# Altium schematic sheet SAMV71_Xplained_Ultra_Memory.SchDoc: Memory
size A3; Organization: ATMEL Norway; Address1: Vestre Rosten 79; Address2: N-7075 TILLER; Address3: NORWAY; DocumentNumber: A09-2407; Revision: 11; SheetNumber: 9; SheetTotal: 13; DrawnBy: Microchip Norway; Engineer: AH; PageSetup: Record=PageOptions|CenterHorizontal=True|CenterVertical=True|PrintScale=1.01|XCorrection=1.00|YCorrection=1.00|PrintKind=1|BorderSize=5000000|LeftOffset=0|BottomOffset=0|Orientation=2|PaperLength=1000|PaperWidth=1000|Scale=100|PaperSource=7|PrintQuality=-4|MediaType=1|DitherType=10|PaperKind=A3 (297 x 420 mm)|PrintScaleMode=1; ProjectTitle: SAM V71 Xplained Ultra; PCBNumber: A08-2216; PCBRevision: 4
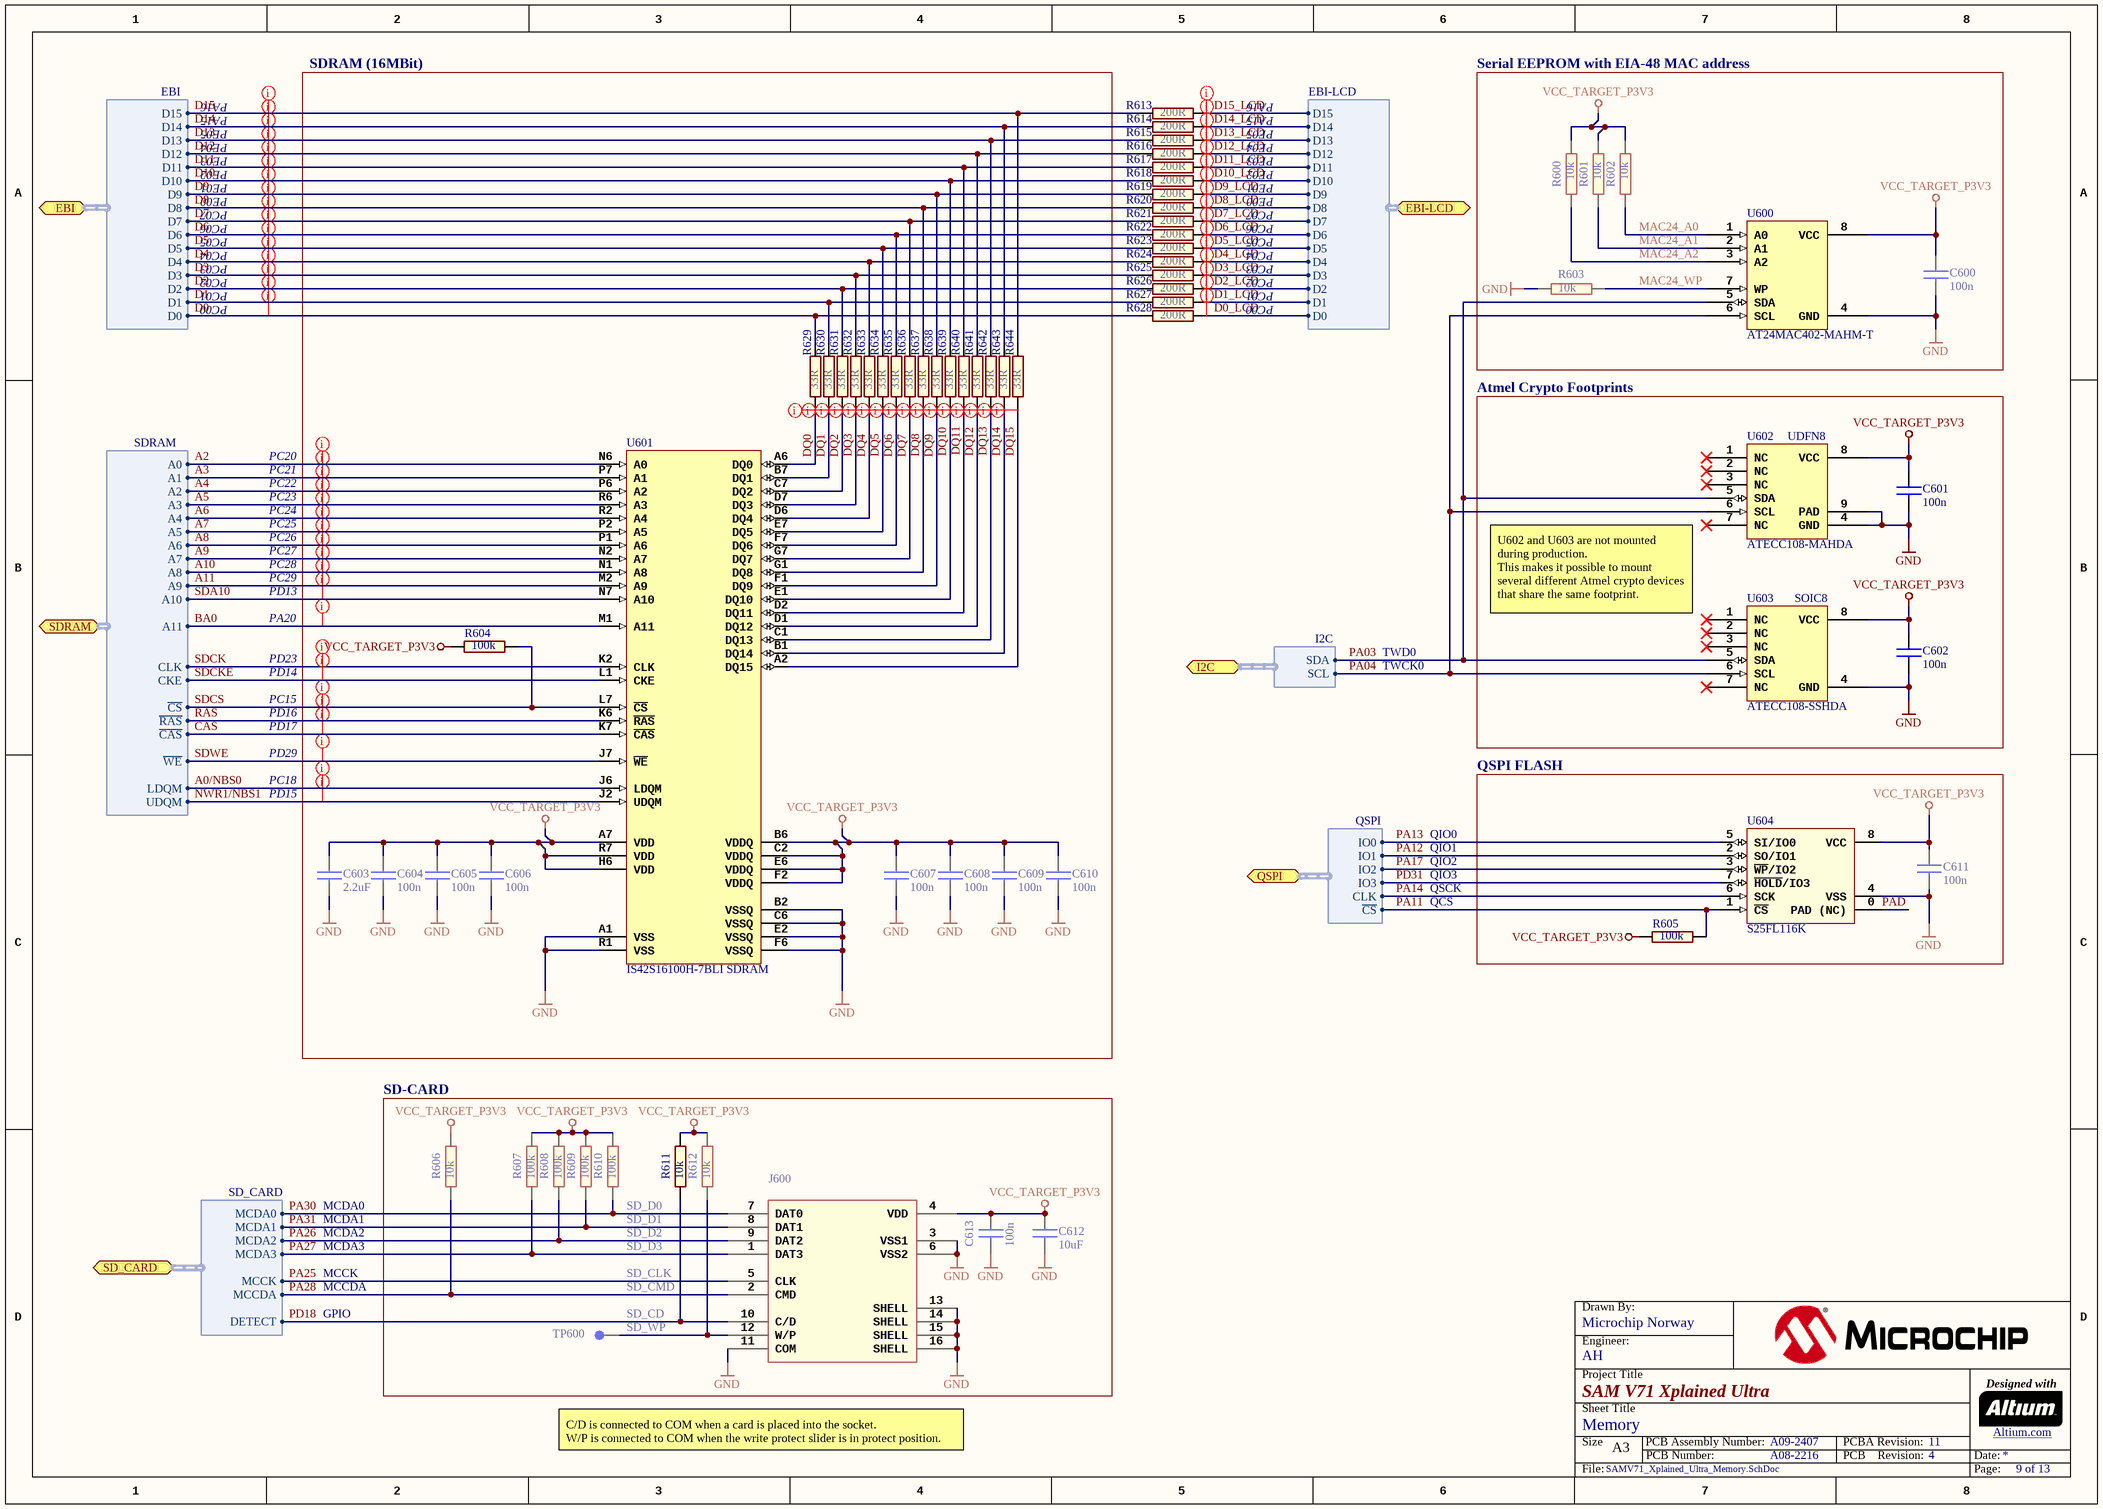
[diagram p0: SAMV71_Xplained_Ultra_Memory.SchDoc]

## Parts
C600  value 100n  [AP1-00001]
C601  value 100n  [AP1-00001]
C602  value 100n  [AP1-00001]
C603  value 2.2uF  [AP1-00053]  (hidden comment: Farnell no: 1288200)
C604  value 100n  [AP1-00053]
C605  value 100n  [AP1-00053]
C606  value 100n  [AP1-00053]
C607  value 100n  [AP1-00053]
C608  value 100n  [AP1-00053]
C609  value 100n  [AP1-00053]
C610  value 100n  [AP1-00053]
C611  value 100n  [AP1-00001]
C612  value 10uF  [AP1-00041]
C613  value 100n  [AP1-00001]
J600  (no value)  [AP8-00377]
R600  value 10k  [AP2-00000]
R601  value 10k  [AP2-00000]
R602  value 10k  [AP2-00000]
R603  value 10k  [AP2-00000]
R604  value 100k  [AP2-00000]
R605  value 100k  [AP2-00000]
R606  value 10k  [AP2-00000]
R607  value 100k  [AP2-00000]
R608  value 100k  [AP2-00000]
R609  value 100k  [AP2-00000]
R610  value 100k  [AP2-00000]
R611  value 10k  [AP2-00000]
R612  value 10k  [AP2-00000]
R613  value 200R  [AP2-00011]
R614  value 200R  [AP2-00011]
R615  value 200R  [AP2-00011]
R616  value 200R  [AP2-00011]
R617  value 200R  [AP2-00011]
R618  value 200R  [AP2-00011]
R619  value 200R  [AP2-00011]
R620  value 200R  [AP2-00011]
R621  value 200R  [AP2-00011]
R622  value 200R  [AP2-00011]
R623  value 200R  [AP2-00011]
R624  value 200R  [AP2-00011]
R625  value 200R  [AP2-00011]
R626  value 200R  [AP2-00011]
R627  value 200R  [AP2-00011]
R628  value 200R  [AP2-00011]
R629  value 33R  [AP2-00011]
R630  value 33R  [AP2-00011]
R631  value 33R  [AP2-00011]
R632  value 33R  [AP2-00011]
R633  value 33R  [AP2-00011]
R634  value 33R  [AP2-00011]
R635  value 33R  [AP2-00011]
R636  value 33R  [AP2-00011]
R637  value 33R  [AP2-00011]
R638  value 33R  [AP2-00011]
R639  value 33R  [AP2-00011]
R640  value 33R  [AP2-00011]
R641  value 33R  [AP2-00011]
R642  value 33R  [AP2-00011]
R643  value 33R  [AP2-00011]
R644  value 33R  [AP2-00011]
TP600  (no value)  [AP8-00010]  (no BOM)
U600  value AT24MAC402-MAHM-T  [AP6-00186]
U601  value IS42S16100H-7BLI SDRAM  [AP6-00400]
U602  value ATECC108-MAHDA  [AP6-00409]
U603  value ATECC108-SSHDA  [AP6-00071]
U604  value S25FL116K  [AP6-00402]  (hidden comment: Also available as 32- and 64-Mbit.)

## Blocks framed on the sheet
SDRAM (16MBit): C603-C610 R604 R629-R644 U601
Serial EEPROM with EIA-48 MAC address: C600 R600-R603 U600
Atmel Crypto Footprints: C601 C602 U602 U603
QSPI FLASH: C611 R605 U604
SD-CARD: C612 C613 J600 R606-R612 TP600

## Ports
EBI (harness EBI), EBI-LCD (harness EBI-LCD), I2C (harness I2C), QSPI (harness QSPI), SD_CARD (harness SD_CARD), SDRAM (harness SDRAM)

## Harnesses
SD_CARD: MCCDA, MCCK, MCDA3, MCDA2, MCDA1, MCDA0, DETECT
EBI: D0, D1, D2, D3, D4, D5, D6, D7, D8, D9, D10, D11, D12, D13, D14, D15
QSPI: CLK, IO3, IO2, IO0, IO1, ~{CS}
SDRAM: ~{CAS}, ~{RAS}, ~{CS}, CLK, CKE, ~{WE}, LDQM, UDQM, A0, A1, A2, A3, A4, A5, A6, A7, A8, A9, A10, A11
I2C: SDA, SCL
EBI-LCD: D0, D1, D2, D3, D4, D5, D6, D7, D8, D9, D10, D11, D12, D13, D14, D15

## Nets
GND: C600.2 C601.2 C602.2 C603.2 C604.2 C605.2 C606.2 C607.2 C608.2 C609.2 C610.2 C611.2 C612.2 C613.2 J600.3(VSS1) J600.6(VSS2) J600.11(COM) J600.13(SHELL) J600.14(SHELL) J600.15(SHELL) J600.16(SHELL) R603.1 U600.4(GND) U601.A1(VSS) U601.B2(VSSQ) U601.C6(VSSQ) U601.E2(VSSQ) U601.F6(VSSQ) U601.R1(VSS) U602.4(GND) U602.9(PAD) U603.4(GND) U604.4(VSS)
VCC_TARGET_P3V3: C600.1 C601.1 C602.1 C603.1 C604.1 C605.1 C606.1 C607.1 C608.1 C609.1 C610.1 C611.1 C612.1 C613.1 J600.4(VDD) R600.2 R601.2 R602.2 R604.1 R605.1 R606.2 R607.2 R608.2 R609.2 R610.2 R611.2 R612.2 U600.8(VCC) U601.A7(VDD) U601.B6(VDDQ) U601.C2(VDDQ) U601.E6(VDDQ) U601.F2(VDDQ) U601.H6(VDD) U601.R7(VDD) U602.8(VCC) U603.8(VCC) U604.8(VCC)
A0/NBS0: U601.J6(LDQM) ; port SDRAM.LDQM
A2: U601.N6(A0) ; port SDRAM.A0
A3: U601.P7(A1) ; port SDRAM.A1
A4: U601.P6(A2) ; port SDRAM.A2
A5: U601.R6(A3) ; port SDRAM.A3
A6: U601.R2(A4) ; port SDRAM.A4
A7: U601.P2(A5) ; port SDRAM.A5
A8: U601.P1(A6) ; port SDRAM.A6
A9: U601.N2(A7) ; port SDRAM.A7
A10: U601.N1(A8) ; port SDRAM.A8
A11: U601.M2(A9) ; port SDRAM.A9
BA0: U601.M1(A11) ; port SDRAM.A11
CAS: U601.K7(~{CAS}) ; port SDRAM.~{CAS}
D0: R628.2 R629.1 ; port EBI.D0
D0_LCD: R628.1 ; port EBI-LCD.D0
D1: R627.2 R630.1 ; port EBI.D1
D1_LCD: R627.1 ; port EBI-LCD.D1
D2: R626.2 R631.1 ; port EBI.D2
D2_LCD: R626.1 ; port EBI-LCD.D2
D3: R625.2 R632.1 ; port EBI.D3
D3_LCD: R625.1 ; port EBI-LCD.D3
D4: R624.2 R633.1 ; port EBI.D4
D4_LCD: R624.1 ; port EBI-LCD.D4
D5: R623.2 R634.1 ; port EBI.D5
D5_LCD: R623.1 ; port EBI-LCD.D5
D6: R622.2 R635.1 ; port EBI.D6
D6_LCD: R622.1 ; port EBI-LCD.D6
D7: R621.2 R636.1 ; port EBI.D7
D7_LCD: R621.1 ; port EBI-LCD.D7
D8: R620.2 R637.1 ; port EBI.D8
D8_LCD: R620.1 ; port EBI-LCD.D8
D9: R619.2 R638.1 ; port EBI.D9
D9_LCD: R619.1 ; port EBI-LCD.D9
D10: R618.2 R639.1 ; port EBI.D10
D10_LCD: R618.1 ; port EBI-LCD.D10
D11: R617.2 R640.1 ; port EBI.D11
D11_LCD: R617.1 ; port EBI-LCD.D11
D12: R616.2 R641.1 ; port EBI.D12
D12_LCD: R616.1 ; port EBI-LCD.D12
D13: R615.2 R642.1 ; port EBI.D13
D13_LCD: R615.1 ; port EBI-LCD.D13
D14: R614.2 R643.1 ; port EBI.D14
D14_LCD: R614.1 ; port EBI-LCD.D14
D15: R613.2 R644.1 ; port EBI.D15
D15_LCD: R613.1 ; port EBI-LCD.D15
DQ0: R629.2 U601.A6(DQ0)
DQ1: R630.2 U601.B7(DQ1)
DQ2: R631.2 U601.C7(DQ2)
DQ3: R632.2 U601.D7(DQ3)
DQ4: R633.2 U601.D6(DQ4)
DQ5: R634.2 U601.E7(DQ5)
DQ6: R635.2 U601.F7(DQ6)
DQ7: R636.2 U601.G7(DQ7)
DQ8: R637.2 U601.G1(DQ8)
DQ9: R638.2 U601.F1(DQ9)
DQ10: R639.2 U601.E1(DQ10)
DQ11: R640.2 U601.D2(DQ11)
DQ12: R641.2 U601.D1(DQ12)
DQ13: R642.2 U601.C1(DQ13)
DQ14: R643.2 U601.B1(DQ14)
DQ15: R644.2 U601.A2(DQ15)
MAC24_A0: R602.1 U600.1(A0)
MAC24_A1: R601.1 U600.2(A1)
MAC24_A2: R600.1 U600.3(A2)
MAC24_WP: R603.2 U600.7(WP)
NWR1/NBS1: U601.J2(UDQM) ; port SDRAM.UDQM
PA03: U600.5(SDA) U602.5(SDA) U603.5(SDA) ; port I2C.SDA
PA04: U600.6(SCL) U602.6(SCL) U603.6(SCL) ; port I2C.SCL
PA11: R605.2 U604.1(~{CS}) ; port QSPI.~{CS}
PA12: U604.2(SO/IO1) ; port QSPI.IO1
PA13: U604.5(SI/IO0) ; port QSPI.IO0
PA14: U604.6(SCK) ; port QSPI.CLK
PA17: U604.3(~{WP}/IO2) ; port QSPI.IO2
PA25: J600.5(CLK) ; port SD_CARD.MCCK
PA26: J600.9(DAT2) R608.1 ; port SD_CARD.MCDA2
PA27: J600.1(DAT3) R607.1 ; port SD_CARD.MCDA3
PA28: J600.2(CMD) R606.1 ; port SD_CARD.MCCDA
PA30: J600.7(DAT0) R610.1 ; port SD_CARD.MCDA0
PA31: J600.8(DAT1) R609.1 ; port SD_CARD.MCDA1
PAD: U604.0(PAD_(NC))
PD18: J600.10(C/D) R611.1 ; port SD_CARD.DETECT
PD31: U604.7(~{HOLD}/IO3) ; port QSPI.IO3
RAS: U601.K6(~{RAS}) ; port SDRAM.~{RAS}
SDA10: U601.N7(A10) ; port SDRAM.A10
SDCK: U601.K2(CLK) ; port SDRAM.CLK
SDCKE: U601.L1(CKE) ; port SDRAM.CKE
SDCS: R604.2 U601.L7(~{CS}) ; port SDRAM.~{CS}
SDWE: U601.J7(~{WE}) ; port SDRAM.~{WE}
NetJ600_12: J600.12(W/P) R612.1 TP600.1

Not connected (* = marked no-connect by the designer): U602 1(NC)* 2(NC)* 3(NC)* 7(NC)*; U603 1(NC)* 2(NC)* 3(NC)* 7(NC)*

## Layout directives
net class ADDRESS_BUS: A0/NBS0, A2, A3, A4, A5, A6, A7, A8, A9, A10, A11, BA0, CAS, NWR1/NBS1, RAS, SDA10, SDCK, SDCS, SDWE
net class DATA_BUS: D0, D4, D5, D7, D8, D9, D10, D11, D12, D13, D14
net class DATA_BUS; rule Fabrication Testpoint Usage [Testpoint - Allowed    Multiple - Not Allowed]; rule Assembly Testpoint Usage [Testpoint - Allowed    Multiple - Not Allowed]: D0_LCD, D1, D1_LCD, D2, D2_LCD, D3, D3_LCD, D4_LCD, D5_LCD, D6, D6_LCD, D7_LCD, D8_LCD, D9_LCD, D10_LCD, D11_LCD, D12_LCD, D13_LCD, D14_LCD, D15, D15_LCD, DQ0, DQ1, DQ2, DQ3, DQ4, DQ5, DQ6, DQ7, DQ8, DQ9, DQ10, DQ11, DQ12, DQ13, DQ14, DQ15
net class ADDRESS_BUS; rule Fabrication Testpoint Usage [Testpoint - Allowed    Multiple - Not Allowed]; rule Assembly Testpoint Usage [Testpoint - Allowed    Multiple - Not Allowed]: SDCKE

## Notes on the sheet
- PA15
- PA16
- PE01
- PE02
- PE03
- PE04
- PE05
- PC04
- PC05
- PC06
- PC07
- PE00
- PC00
- PC01
- PC02
- PC03
- (near U602) UDFN8
- PC20
- PC21
- PC22
- PC23
- PC24
- PC25
- PC26
- PC27
- PC28
- PC29
- PD13
- PA20
- U602 and U603 are not mounted during production.
  This makes it possible to mount several different Atmel crypto devices that share the same footprint.
- (near U603) SOIC8
- PD14
- PD23
- PC15
- PD16
- TWCK0
- TWD0
- PD17
- PC18
- PD29
- PD15
- QIO0
- QIO1
- QIO2
- QIO3
- QSCK
- QCS
- MCDA0
- MCDA1
- MCDA2
- MCDA3
- SD_D0
- SD_D1
- SD_D2
- SD_D3
- GPIO
- MCCK
- MCCDA
- SD_CLK
- (near TP600) SD_CMD
- (near TP600) SD_CD
- (near TP600) SD_WP
- C/D is connected to COM when a card is placed into the socket.
  W/P is connected to COM when the write protect slider is in protect position.
- Drawn By:
- Project Title
- Engineer:
- Designed with
- Sheet Title
- Size
- A3
- PCB Number:
- PCB Assembly Number:
- PCBA Revision:
- PCB    Revision:
- Date:
- Altium.com <http://go.altium.com/MicrochipLandingPage_Evaluation.html>
- File:
- Page:

## Library data of the parts
C600-C602 C604-C611 C613 = A01-0246: Ceramic capacitor, SMD 0402, X7R, 16V, +/-10%; PartGroup: Capacitors,Ceramic,SMD 0402; Manufacturer: Kemet; MPN: C0402C104K4RACTU; TemperatureRange: -55 - +125 deg C; Status: Active; AN: A01-0246; Tolerance: 16V, +/-10%; Height: 0,5
C603 = A01-0300: Ceramic capacitor, SMD 0402, X5R, 6.3V, +/-20%; PartGroup: Capacitors,Ceramic,SMD 0402; Manufacturer: Kemet; MPN: C0402C225M9PAC; Tolerance: Â±20%; TemperatureRange: -55Â°C to +85Â°C; Status: Active; AN: A01-0300; Height: 0,5
C612 = A01-0360: Ceramic capacitor, SMD 0805, X5R, 10V, 10 %, (de19441); PartGroup: Capacitors,Ceramic,SMD 0805; Manufacturer: Murata; MPN: GRM21BR61A106KE19L; Tolerance: 10%; TemperatureRange: -55 - +85 deg C; Status: Active; AN: A01-0360; Height: 1,25
J600 = A08-0816: SD/MMC socket, 2.7mm, push-push, SMD; PartGroup: Mechanical devices,Connectors,Memory cards; Manufacturer: Kyocera-elco; Value: KYOCERA - 14 5738 009 220 859+; TemperatureRange: -25 deg C to 90 deg C; AN: A08-0816; Height: 2,70000004768372; MPN: KYOCERA - 14 5738 009 220 859+
R600-R603 R606 R611 R612 = A02-0236: Thick film resistor, SMD 0402, 1/16W, 1%; PartGroup: Resistors,SMD,0402 1%; Manufacturer: vishay; MPN: CRCW040210K0FKED; TemperatureRange: -55 - +125 deg C; Status: Active; AN: A02-0236; Tolerance: 1 %; Height: 0,349999994039536
R604 R605 R607-R610 = A02-0260: Thick film resistor, SMD 0402, 1/16W, 1%; PartGroup: Resistors,SMD,0402 1%; Manufacturer: ASJ; MPN: CR10-1003-FK; TemperatureRange: -55ï¿½ to +125ï¿½C; Status: Active; AN: A02-0260; Tolerance: 1 %; Height: 0,349999994039536
R613-R628 = A02-0195: Thick film resistor, SMD 0402, 1/16W, 1%; PartGroup: Resistors,SMD,0402 1%; TemperatureRange: -55 - +125 deg C; Status: Active; AN: A02-0195; Tolerance: 1 %; Height: 0,349999994039536
R629-R644 = A02-0176: Thick film resistor, SMD 0402, 1/16W, 1%; PartGroup: Resistors,SMD,0402 1%; Manufacturer: ASJ; MPN: CR10-33R0-FK; TemperatureRange: -55 - +125 deg C; Status: Active; AN: A02-0176; Tolerance: 1 %; Height: 0,349999994039536
TP600 = A08-0004: Single SMD testpad; PartGroup: Mechanical devices,Connectors,Test points; Status: Active; AN: A08-0004; Value: TESTPAD; Height: 0
U600 = A06-1169: 2kbit I2C EEPROM, single EUI-48 MAC, 1.7-5.5V, 2x3mm UDFN (8MA2); PartGroup: Integrated Circuits,Memory,EEPROM; Manufacturer: ATMEL; TemperatureRange: â€“40Â°C to +85Â°C; AN: A06-1169; Height: 0,600000023841858; MPN: AT24MAC402-MAHM-T
U601 = A06-1472: 16Mbit  SDRAM (512K Words x 16 Bits x 2 Banks), 143 MHz 3,3V; PartGroup: Integrated Circuits,Memory,SDRAM; Manufacturer: ISSI; MPN: IS42S16100H-7BLI; TemperatureRange: -40C to +85C; AN: A06-1472; Height: 1,20000004768372
U602 = A06-1181: Secure authentication and product validation device, EEPROM, I2C, 2.0 - 5.5V, UDFN8; PartGroup: Integrated Circuits,Special function,Encryption; Manufacturer: ATMEL; MPN: ATECC108-MAHDA-T; TemperatureRange: -40Â°C to +85Â°C; AN: A06-1181; Status: New; Height: 0,600000023841858
U603 = A06-1182: Secure authentication and product validation device, EEPROM, I2C, 2.0 - 5.5V, SOIC8; PartGroup: Integrated Circuits,Special function,Encryption; Manufacturer: ATMEL; MPN: ATECC108-SSHDA-T; TemperatureRange: -40Â°C to +85Â°C; AN: A06-1182; Status: New; Height: 1,75
U604 = A06-1162: 16 Mbit (2MB) SPI Quad I/O flash, 3.3V, 108MHz, WSON-8, industrial temperature; PartGroup: Integrated Circuits,Memory,FLASH; Manufacturer: Spansion; MPN: S25FL116K0XNFI013; TemperatureRange: -40Â°C to +85Â°C; AN: A06-1162; Height: 0,800000011920929